# Altium schematic sheet Interfaces.SchDoc: RS485 & RS422 Interface
size A4; Author: Farzin Rezaei; DrawnBy: Farzin Rezaei; DocumentNumber: Doc14020803; Revision: 0.0.1
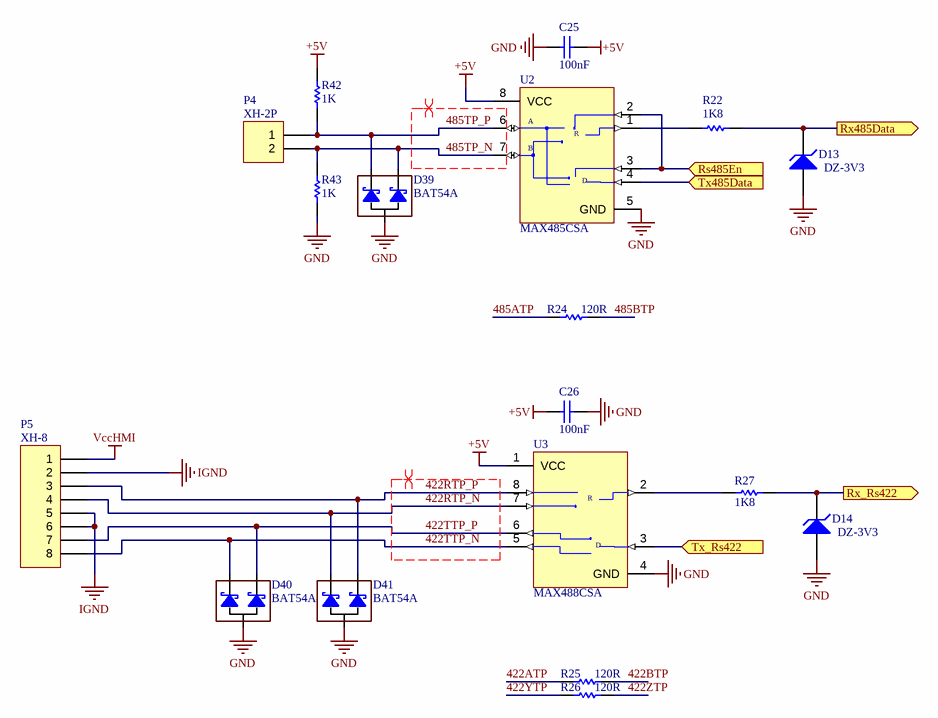
[diagram p0: Interfaces.SchDoc]

## Parts
C25  100nF  [0603C]
C26  100nF  [0603C]
D13  DZ-3V3  [1206D]
D14  DZ-3V3  [1206D]
D39  BAT54A  [SOT-23-3 2.9X2.4MM P0.95MM]
D40  BAT54A  [SOT-23-3 2.9X2.4MM P0.95MM]
D41  BAT54A  [SOT-23-3 2.9X2.4MM P0.95MM]
P4  XH-2P  [JST-XH-2W]
P5  XH-8  [JST-XH-8W]
R22  1K8  [0603R]
R24  120R  [0805R]
R25  120R  [0805R]
R26  120R  [0805R]
R27  1K8  [0603R]
R42  1K  [0603R]
R43  1K  [0603R]
U2  MAX485CSA  [SO-8]
U3  MAX488CSA  [SO-8]

## Ports
Rs485En (in), Rx485Data (out), Rx_Rs422 (out), Tx485Data (in), Tx_Rs422 (in)

## Nets
+5V: C25.2 C26.2 R42.2 U2.8(VCC) U3.1(VCC)
GND: C25.1 C26.1 D13.1(A) D14.1(A) D39.3 D40.3 D41.3 R43.1 U2.5(GND) U3.4(GND)
IGND: P5.2 P5.5 P5.6
VccHMI: P5.1
422ATP: R25.1
422BTP: R25.2
422RTP_N: D41.2 P5.4 U3.7(B)
422RTP_P: D41.1 P5.3 U3.8(A)
422TTP_N: D40.2 P5.8 U3.5(Y)
422TTP_P: D40.1 P5.7 U3.6(Z)
422YTP: R26.1
422ZTP: R26.2
485ATP: R24.1
485BTP: R24.2
485TP_N: D39.1 P4.2 R43.2 U2.7(B)
485TP_P: D39.2 P4.1 R42.1 U2.6(A)
Rs485En: U2.2(~{RE}) U2.3(DE) ; port Rs485En
Rx485Data: D13.2(K) R22.2 ; port Rx485Data
Rx_Rs422: D14.2(K) R27.2 ; port Rx_Rs422
Tx485Data: U2.4(DI) ; port Tx485Data
Tx_Rs422: U3.3(DI) ; port Tx_Rs422
NetR22_1: R22.1 U2.1(RO)
NetR27_1: R27.1 U3.2(RO)

## Layout directives
differential pair; rule Differential Pairs Routing [Pref Gap = 15mil    Min Gap  = 10mil    Max Gap  = 15milPref Width = 15mil    Min Width  = 15mil    Max Width  = 20mil]; net class RsBusClass; differential pair class RsBusClassRs422: 422RTP_N, 422RTP_P, 422TTP_N, 422TTP_P
differential pair; rule Differential Pairs Routing [Pref Gap = 15mil    Min Gap  = 10mil    Max Gap  = 15milPref Width = 15mil    Min Width  = 15mil    Max Width  = 20mil]; net class RsBusClass; differential pair class RsBusClassRs485: 485TP_N, 485TP_P

## Notes on the sheet
- (in symbol MAX485CSA) R; D
- (in symbol MAX488CSA) R; D

## Library data of the parts
C25 C26 = Cap: Value: 100nF
D13 D14 = D Zener
D39-D41 = BAT54A (SMD): Diode Array 1 Pair Series Connection Schottky 30V 200mA Surface Mount TO-236-3, SC-59, SOT-23-3; PartNumber: BAT54A
P4 = Header 2
P5 = Header 8: Header, 8-Pin; LatestRevisionDate: 17-Jul-2002; LatestRevisionNote: Re-released for DXP Platform.; Publisher: Altium Limited
R22 = Res1: Value: 120R
R24-R26 R42 R43 = Res1
  R24-R26: Value: 120R
  R42 R43: Value: 1K
R27 = Res1: Value: 1K
U3 = MAX488CSA: montage: true; DatasheetVersion: Feb-1996; Code_JEDEC: MS-012-AA; Code_IPC: SOIC127P600-8; ComponentLink1Description: Manufacturer Link; ComponentLink1URL: http://www.maxim-ic.com/; ComponentLink2Description: Datasheet; ComponentLink2URL: http://pdfserv.maxim-ic.com/en/ds/MAX1487-MAX491.pdf
U2 = MAX485CSA: DatasheetVersion: Feb-1996; Code_JEDEC: MS-012-AA; Code_IPC: SOIC127P600-8; ComponentLink1Description: Manufacturer Link; ComponentLink1URL: http://www.maxim-ic.com/; ComponentLink2Description: Datasheet; ComponentLink2URL: http://pdfserv.maxim-ic.com/en/ds/MAX1487-MAX491.pdf